# Altium project NSKPD.PrjPCB
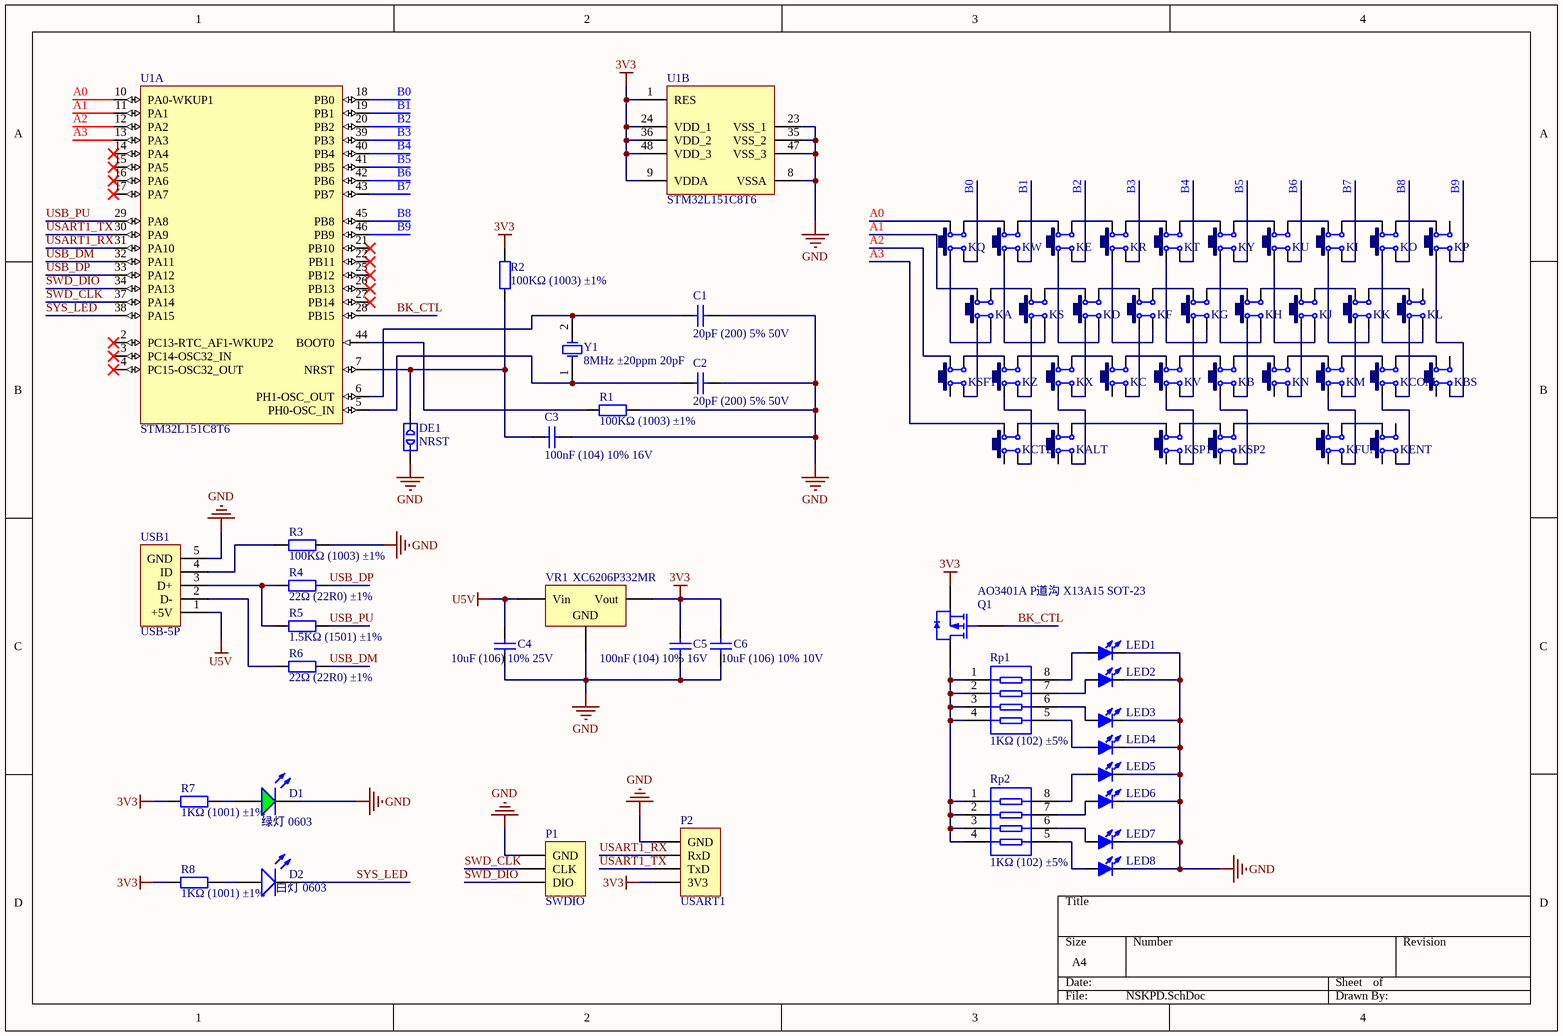
[diagram p0: NSKPD.SchDoc]
1 sheet, 69 parts. Net scope: global (net labels, ports and power ports of the same name join across sheets).
Board file: NSKPD.PcbDoc

## Sheet NSKPD.SchDoc
size A4

### Parts
C1  20pF (200) 5% 50V  [0402_C]
C2  20pF (200) 5% 50V  [0402_C]
C3  100nF (104) 10% 16V  [0402_C]
C4  10uF (106) 10% 25V  [0805_C]
C5  100nF (104) 10% 16V  [0402_C]
C6  10uF (106) 10% 10V  [0603_C]
D1  绿灯 0603  [0603_LED_S1]
D2  白灯 0603  [0603_LED_S1]
DE1  NRST  [DEBUG_A]
KA  6x6x5  [6*6*4.3 Small]  (value not drawn)
KALT  6x6x5  [6*6*4.3 Small]  (value not drawn)
KB  6x6x5  [6*6*4.3 Small]  (value not drawn)
KBS  6x6x5  [6*6*4.3 Small]  (value not drawn)
KC  6x6x5  [6*6*4.3 Small]  (value not drawn)
KCOM  6x6x5  [6*6*4.3 Small]  (value not drawn)
KCTL  6x6x5  [6*6*4.3 Small]  (value not drawn)
KD  6x6x5  [6*6*4.3 Small]  (value not drawn)
KE  6x6x5  [6*6*4.3 Small]  (value not drawn)
KENT  6x6x5  [6*6*4.3 Small]  (value not drawn)
KF  6x6x5  [6*6*4.3 Small]  (value not drawn)
KFUN  6x6x5  [6*6*4.3 Small]  (value not drawn)
KG  6x6x5  [6*6*4.3 Small]  (value not drawn)
KH  6x6x5  [6*6*4.3 Small]  (value not drawn)
KI  6x6x5  [6*6*4.3 Small]  (value not drawn)
KJ  6x6x5  [6*6*4.3 Small]  (value not drawn)
KK  6x6x5  [6*6*4.3 Small]  (value not drawn)
KL  6x6x5  [6*6*4.3 Small]  (value not drawn)
KM  6x6x5  [6*6*4.3 Small]  (value not drawn)
KN  6x6x5  [6*6*4.3 Small]  (value not drawn)
KO  6x6x5  [6*6*4.3 Small]  (value not drawn)
KP  6x6x5  [6*6*4.3 Small]  (value not drawn)
KQ  6x6x5  [6*6*4.3 Small]  (value not drawn)
KR  6x6x5  [6*6*4.3 Small]  (value not drawn)
KS  6x6x5  [6*6*4.3 Small]  (value not drawn)
KSFT  6x6x5  [6*6*4.3 Small]  (value not drawn)
KSP1  6x6x5  [6*6*4.3 Small]  (value not drawn)
KSP2  6x6x5  [6*6*4.3 Small]  (value not drawn)
KT  6x6x5  [6*6*4.3 Small]  (value not drawn)
KU  6x6x5  [6*6*4.3 Small]  (value not drawn)
KV  6x6x5  [6*6*4.3 Small]  (value not drawn)
KW  6x6x5  [6*6*4.3 Small]  (value not drawn)
KX  6x6x5  [6*6*4.3 Small]  (value not drawn)
KY  6x6x5  [6*6*4.3 Small]  (value not drawn)
KZ  6x6x5  [6*6*4.3 Small]  (value not drawn)
LED1  侧发光  [LED 0805W]  (value not drawn)
LED2  侧发光  [LED 0805W]  (value not drawn)
LED3  侧发光  [LED 0805W]  (value not drawn)
LED4  侧发光  [LED 0805W]  (value not drawn)
LED5  侧发光  [LED 0805W]  (value not drawn)
LED6  侧发光  [LED 0805W]  (value not drawn)
LED7  侧发光  [LED 0805W]  (value not drawn)
LED8  侧发光  [LED 0805W]  (value not drawn)
P1  SWDIO  [HDR1X3]
P2  USART1  [HDR1X4]
Q1  AO3401A P道沟 X13A15 SOT-23  [SOT-23-3L]
R1  100KΩ (1003) ±1%  [0402_R]
R2  100KΩ (1003) ±1%  [0402_R]
R3  100KΩ (1003) ±1%  [0402_R]
R4  22Ω (22R0) ±1%  [0402_R]
R5  1.5KΩ (1501) ±1%  [0402_R]
R6  22Ω (22R0) ±1%  [0402_R]
R7  1KΩ (1001) ±1%  [0402_R]
R8  1KΩ (1001) ±1%  [0402_R]
Rp1  1KΩ (102) ±5%  [0402_Rx4]
Rp2  1KΩ (102) ±5%  [0402_Rx4]
U1  STM32L151C8T6  [LQFP-48_7x7x05P]  (parts A,B of 2)
USB1  USB-5P  [USB-MICRO_D]
VR1  XC6206P332MR  [SOT-23-3L]
Y1  8MHz ±20ppm 20pF  [SMD-5032_2P]

### Nets
3V3: C5.2 C6.2 P2.4(3V3) Q1.2(S) R2.2 R7.1 R8.2 U1.1(RES) U1.9(VDDA) U1.24(VDD_1) U1.36(VDD_2) U1.48(VDD_3) VR1.2(Vout)
GND: C1.2 C2.2 C3.1 C4.1 C5.1 C6.1 D1.K DE1.2 LED1.2(K) LED2.2(K) LED3.2(K) LED4.2(K) LED5.2(K) LED6.2(K) LED7.2(K) LED8.2(K) P1.1(GND) P2.1(GND) R1.2 R3.2 U1.8(VSSA) U1.23(VSS_1) U1.35(VSS_2) U1.47(VSS_3) USB1.5(GND) VR1.1(GND)
U5V: C4.2 USB1.1(+5V) VR1.3(Vin)
A0: KQ.2 U1.10(PA0-WKUP1)
A1: KA.2 U1.11(PA1)
A2: KSFT.2 U1.12(PA2)
A3: KCTL.2 U1.13(PA3)
B0: KQ.4 U1.18(PB0)
B1: KW.4 U1.19(PB1)
B2: KE.4 U1.20(PB2)
B3: KR.4 U1.39(PB3)
B4: KT.4 U1.40(PB4)
B5: KY.4 U1.41(PB5)
B6: KU.4 U1.42(PB6)
B7: KI.4 U1.43(PB7)
B8: KO.4 U1.45(PB8)
B9: KP.4 U1.46(PB9)
BK_CTL: Q1.1(G) U1.28(PB15)
SWD_CLK: P1.2(CLK) U1.37(PA14)
SWD_DIO: P1.3(DIO) U1.34(PA13)
SYS_LED: D2.K U1.38(PA15)
USART1_RX: P2.2(RxD) U1.31(PA10)
USART1_TX: P2.3(TxD) U1.30(PA9)
USB_DM: R6.2 U1.32(PA11)
USB_DP: R4.2 U1.33(PA12)
USB_PU: R5.2 U1.29(PA8)
NetC1_1: C1.1 U1.6(PH1-OSC_OUT) Y1.2(OSC2)
NetC2_1: C2.1 U1.5(PH0-OSC_IN) Y1.1(OSC1)
NetC3_2: C3.2 DE1.1 R2.1 U1.7(NRST)
NetD1_A: D1.A R7.2
NetD2_A: D2.A R8.1
NetKA_1: KA.1 KSFT.4
NetKA_3: KA.3 KS.2
NetKA_4: KA.4 KQ.1
NetKALT_2: KALT.2 KCTL.3
NetKALT_3: KALT.3 KSP1.2
NetKALT_4: KALT.4 KX.1
NetKB_1: KB.1 KSP2.4
NetKB_2: KB.2 KV.3
NetKB_3: KB.3 KN.2
NetKB_4: KB.4 KH.1
NetKBS_2: KBS.2 KCOM.3
NetKBS_4: KBS.4 KP.1
NetKC_2: KC.2 KX.3
NetKC_3: KC.3 KV.2
NetKC_4: KC.4 KF.1
NetKCOM_1: KCOM.1 KENT.4
NetKCOM_2: KCOM.2 KM.3
NetKCOM_4: KCOM.4 KL.1
NetKCTL_4: KCTL.4 KZ.1
NetKD_1: KD.1 KX.4
NetKD_2: KD.2 KS.3
NetKD_3: KD.3 KF.2
NetKD_4: KD.4 KE.1
NetKE_2: KE.2 KW.3
NetKE_3: KE.3 KR.2
NetKENT_2: KENT.2 KFUN.3
NetKF_3: KF.3 KG.2
NetKF_4: KF.4 KR.1
NetKFUN_2: KFUN.2 KSP2.3
NetKFUN_4: KFUN.4 KM.1
NetKG_1: KG.1 KV.4
NetKG_3: KG.3 KH.2
NetKG_4: KG.4 KT.1
NetKH_3: KH.3 KJ.2
NetKH_4: KH.4 KY.1
NetKI_1: KI.1 KK.4
NetKI_2: KI.2 KU.3
NetKI_3: KI.3 KO.2
NetKJ_1: KJ.1 KN.4
NetKJ_3: KJ.3 KK.2
NetKJ_4: KJ.4 KU.1
NetKK_1: KK.1 KM.4
NetKK_3: KK.3 KL.2
NetKL_4: KL.4 KO.1
NetKM_2: KM.2 KN.3
NetKO_3: KO.3 KP.2
NetKQ_3: KQ.3 KW.2
NetKR_3: KR.3 KT.2
NetKS_1: KS.1 KZ.4
NetKS_4: KS.4 KW.1
NetKSFT_3: KSFT.3 KZ.2
NetKSP1_3: KSP1.3 KSP2.2
NetKSP1_4: KSP1.4 KV.1
NetKT_3: KT.3 KY.2
NetKU_2: KU.2 KY.3
NetKX_2: KX.2 KZ.3
NetLED1_1: LED1.1(A) Rp1.8
NetLED2_1: LED2.1(A) Rp1.7
NetLED3_1: LED3.1(A) Rp1.6
NetLED4_1: LED4.1(A) Rp1.5
NetLED5_1: LED5.1(A) Rp2.8
NetLED6_1: LED6.1(A) Rp2.7
NetLED7_1: LED7.1(A) Rp2.6
NetLED8_1: LED8.1(A) Rp2.5
NetQ1_3: Q1.3(D) Rp1.1 Rp1.2 Rp1.3 Rp1.4 Rp2.1 Rp2.2 Rp2.3 Rp2.4
NetR1_1: R1.1 U1.44(BOOT0)
NetR3_1: R3.1 USB1.4(ID)
NetR4_1: R4.1 R5.1 USB1.3(D+)
NetR6_1: R6.1 USB1.2(D-)

Not connected (* = marked no-connect by the designer): KALT 1; KBS 1 3; KC 1; KCTL 1; KENT 1 3; KFUN 1; KL 3; KN 1; KP 3; KSFT 1; KSP1 1; KSP2 1; U1 2(PC13-RTC_AF1-WKUP2)* 3(PC14-OSC32_IN)* 4(PC15-OSC32_OUT)* 14(PA4)* 15(PA5)* 16(PA6)* 17(PA7)* 21(PB10)* 22(PB11)* 25(PB12)* 26(PB13)* 27(PB14)*

### Library data of the parts
C1 C2 = 0402 20pF (200) 5% 50V: 贴片电容; ComponentLink1Description: 供应商链接; ComponentLink1URL: http://www.szlcsc.com/product/details_1906.html; Package: 0402; Supplier: LC; SuppliersPartNumber: C1554
C3 C5 = 0402 100nF (104) 10% 16V: 贴片电容; ComponentLink1Description: 供应商链接; ComponentLink1URL: http://www.szlcsc.com/product/details_1877.html; Package: 0402; Supplier: LC; SuppliersPartNumber: C1525
C4 = 0805 10uF (106) 10% 25V: 贴片电容; ComponentLink1Description: 供应商链接; ComponentLink1URL: http://www.szlcsc.com/product/details_16532.html; Package: 0805; Supplier: LC; SuppliersPartNumber: C15850
C6 = 0603 10uF (106) 10% 10V: 贴片电容; ComponentLink1Description: 供应商链接; ComponentLink1URL: http://www.szlcsc.com/product/details_20411.html; Package: 0603; Supplier: LC; SuppliersPartNumber: C19702
D1 = 0603 绿灯: 发光二极管; ComponentLink1Description: 供应商链接; ComponentLink1URL: http://www.szlcsc.com/product/details_73152.html; Package: 0603; Supplier: LC; SuppliersPartNumber: C72043
D2 = 0603 白灯: 发光二极管; ComponentLink1Description: 供应商链接; ComponentLink1URL: http://www.szlcsc.com/product/details_2663.html; Package: 0603; Supplier: LC; SuppliersPartNumber: C2290
DE1 = DEBUG: 调试断点焊盘; 版权归属: 源创客; BOM名称: 调试断点焊盘; 学习资源: www.ooocke.com
KA KALT KB KBS KC KCOM KCTL KD KE KENT KF KFUN KG KH KI KJ KK KL KM KN KO KP KQ KR KS KSFT KSP1 KSP2 KT KU KV KW KX KY KZ = TSW SMD-6x6: 贴片6x6轻触开关; 版权归属: 源创客; BOM名称: 贴片6x6轻触开关; 学习资源: www.ooocke.com
LED1-LED8 = LED-SMD: 贴片LED; 版权归属: 源创客; BOM名称: 贴片LED; 学习资源: www.ooocke.com
P1 = Header 3: Header, 3-Pin; LatestRevisionDate: 17-Jul-2002; LatestRevisionNote: Re-released for DXP Platform.; Publisher: Altium Limited
P2 = Header 4: Header, 4-Pin; LatestRevisionDate: 17-Jul-2002; LatestRevisionNote: Re-released for DXP Platform.; Publisher: Altium Limited
Q1 = AO3401A P道沟 X13A15 SOT-23: MOS(场效应管); ComponentLink1Description: 供应商链接; ComponentLink1URL: http://www.szlcsc.com/product/details_15801.html; Package: SOT-23; Supplier: LC; SuppliersPartNumber: C15127
R1-R3 = 0402 100KΩ (1003) 1%: 贴片电阻; ComponentLink1Description: 供应商链接; ComponentLink1URL: http://www.szlcsc.com/product/details_26484.html; Package: 0402; Supplier: LC; SuppliersPartNumber: C25741
R4 R6 = 0402 22Ω (22R0) 1%: 贴片电阻; ComponentLink1Description: 供应商链接; ComponentLink1URL: http://www.szlcsc.com/product/details_25835.html; Package: 0402; Supplier: LC; SuppliersPartNumber: C25092
R5 = 0402 1.5KΩ (1501) 1%: 贴片电阻; ComponentLink1Description: 供应商链接; ComponentLink1URL: http://www.szlcsc.com/product/details_26610.html; Package: 0402; Supplier: LC; SuppliersPartNumber: C25867
R7 R8 = 0402 1KΩ (1001) 1%: 贴片电阻; ComponentLink1Description: 供应商链接; ComponentLink1URL: http://www.szlcsc.com/product/details_12256.html; Package: 0402; Supplier: LC; SuppliersPartNumber: C11702
Rp1 Rp2 = 0402*4 1KΩ (102) 5%: 贴片排阻; ComponentLink1Description: 供应商链接; ComponentLink1URL: http://www.szlcsc.com/product/details_26469.html; Package: 0402*4; Supplier: LC; SuppliersPartNumber: C25726
U1 = STM32L151C8T6: ARM; ComponentLink1Description: 供应商链接; ComponentLink1URL: http://www.szlcsc.com/product/details_10393.html; Package: LQFP-48_7x7x05P; Supplier: LC; SuppliersPartNumber: C9861
USB1 = USB-5P: 微型USB母座; 版权归属: 源创客; BOM名称: 微型USB母座; 学习资源: www.ooocke.com
VR1 = SOT-23 XC6206P332MR: 低压差线性稳压(LDO); ComponentLink1Description: 供应商链接; ComponentLink1URL: http://www.szlcsc.com/product/details_5896.html; Package: SOT-23; Supplier: LC; SuppliersPartNumber: C5446
Y1 = SMD-5032_2P 8MHz 20ppm 20pF: 贴片晶振; ComponentLink1Description: 供应商链接; ComponentLink1URL: http://www.szlcsc.com/product/details_117214.html; Package: SMD-5032_2P; Supplier: LC; SuppliersPartNumber: C115962